# Altium schematic sheet FPC-isoIOs-IOpSingle.SchDoc
size A4; SheetNumber: 8; SheetTotal: 15
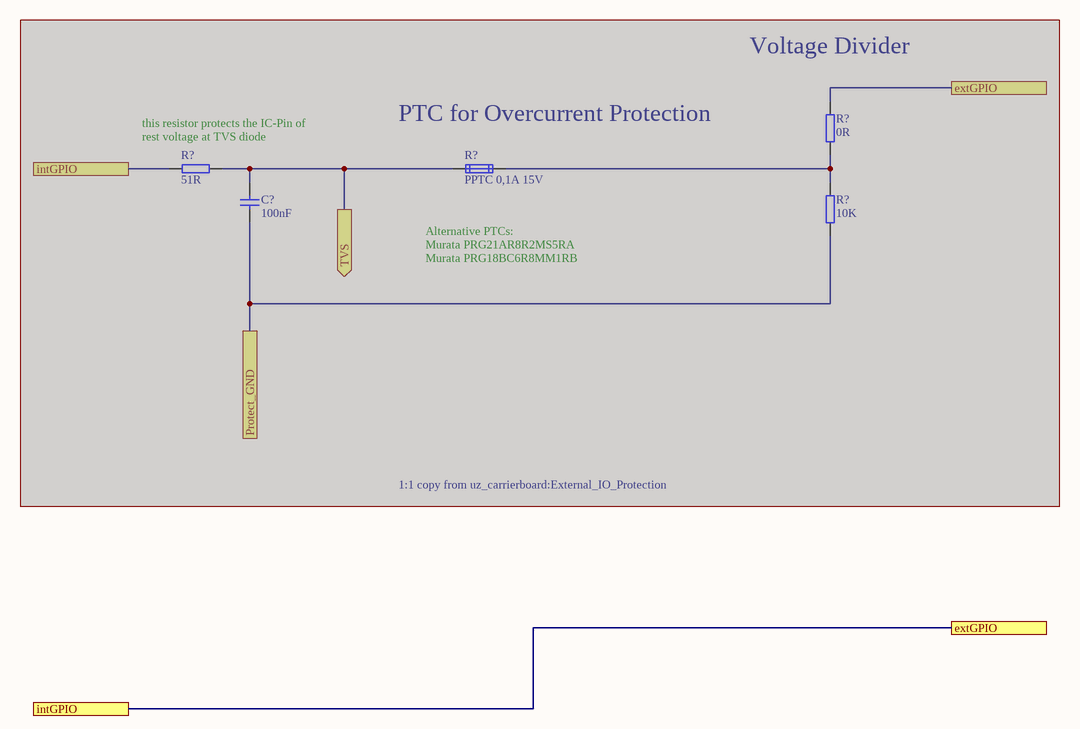
[diagram p0: FPC-isoIOs-IOpSingle.SchDoc]

## Parts
(Parts that share a designator on the sheet are numbered #1, #2 ... from top to bottom, then left to right.)
C?  100nF  [CAPC1608X90N_V]  (masked out: inside a compile mask, not in the netlist)
R?#1  0R  [RESC1608X55N_V]  (masked out: inside a compile mask, not in the netlist)
R?#2  51R  [RESC1608X55N_V]  (masked out: inside a compile mask, not in the netlist)
R?#3  PPTC 0,1A 15V  [RESC2012X85N]  (masked out: inside a compile mask, not in the netlist)
R?#4  10K  [RESC1608X55N_V]  (masked out: inside a compile mask, not in the netlist)

## Ports
extGPIO, intGPIO, Protect_GND, TVS (out)

## Nets
extGPIO: port intGPIO, port extGPIO

## Notes on the sheet
- Voltage Divider
- (near R?#2) this resistor protects the IC-Pin of rest voltage at TVS diode
- (near R?#3) PTC for Overcurrent Protection
- Alternative PTCs:
  Murata PRG21AR8R2MS5RA
  Murata PRG18BC6R8MM1RB
- 1:1 copy from uz_carrierboard:External_IO_Protection
- Title
- Revision:
- Design Engineer:
- Date:
- Project:
- Sheet
- of

## Library data of the parts
C? = 21382: KON 100nF 50V X7R ±10% SMD BF 1608 (0603); Value: 100n; AN: 21382; Mixed: SMT; Preferred: Yes; Temperature-Range: -55/+125; Tolerance: ±10%; Voltage: 50V; Technology: X7R; Case: 1608 (0603)
R?#1 = 21491: WID SMD 0R 0,1W 1% TK100  BF 1608 (0603); Value: 0; AN: 21491; Mixed: SMT; Tolerance: 1%; Case: 1608 (0603); Technology: TK100
R?#2 = 25938: WID SMD 51R 1% 0,1W  BF 1608 (0603); Value: 51; AN: 25938; Mixed: SMT; Preferred: Yes; Tolerance: 1%; Case: 1608 (0603); Technology: TK100
R?#3 = 28044: PTC Resettable Fuse 0.1A 15V SMD 0805; AN: 28044; Mixed: SMT; H-ART: MF-PSMF010X-2; Value: 0.1A; HelpURL: B:\AD\adlib\datasheet\MF-PSMF; Case: 2012 (0805); Voltage: 15V; Extra: MF-PSMF010X-2
R?#4 = 21492: WID SMD 10K 1% 0,1W  BF 1608 (0603); AN: 21492; Mixed: SMT; Preferred: Yes; Value: 10K; Tolerance: 1%; Case: 1608 (0603); Technology: TK100